# Altium schematic sheet Peripheral.SchDoc
size A4; DocumentNumber: 3; SheetNumber: 3; SheetTotal: 4
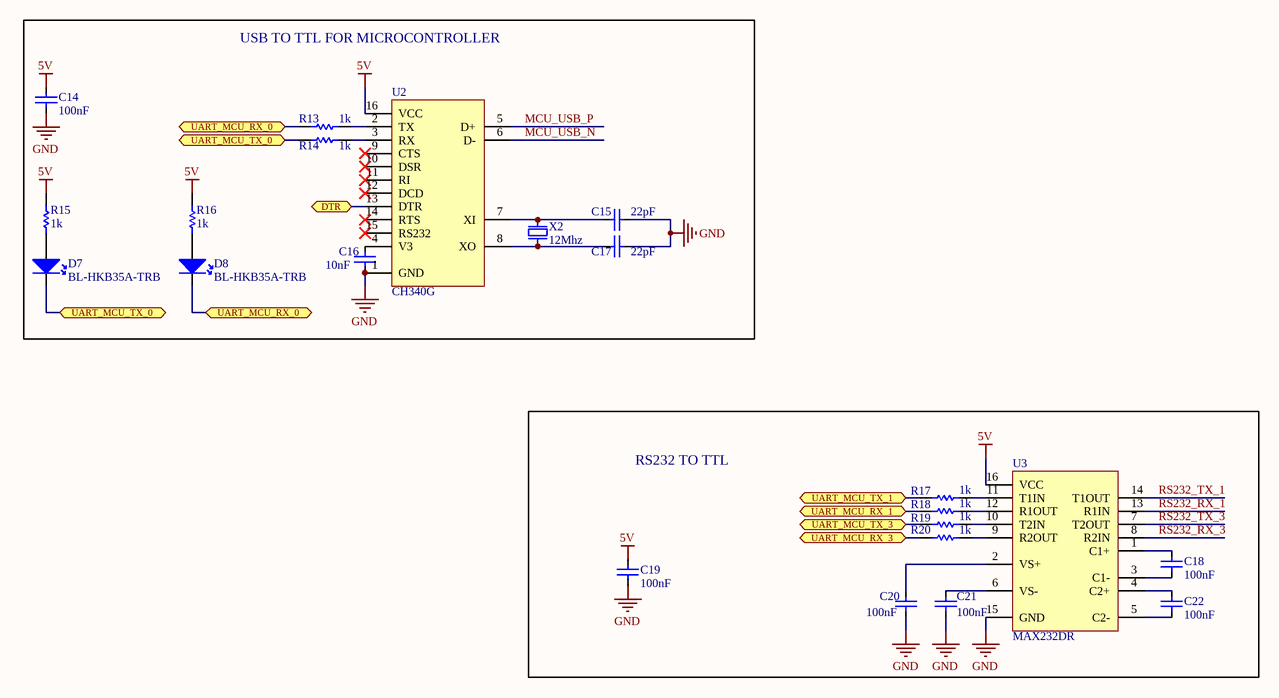
[diagram p0: Peripheral.SchDoc]

## Parts
?  (no value)  (graphical)
C14  100nF  [CAP-0603]
C15  22pF  [CAP-0805]
C16  10nF  [CAP-0603]
C17  22pF  [CAP-0805]
C18  100nF  [CAP-0603]
C19  100nF  [CAP-0603]
C20  100nF  [CAP-0603]
C21  100nF  [CAP-0603]
C22  100nF  [CAP-0603]
D7  BL-HKB35A-TRB  [LED-0805]
D8  BL-HKB35A-TRB  [LED-0805]
R13  1k  [RES-0603]
R14  1k  [RES-0603]
R15  1k  [RES-0603]
R16  1k  [RES-0603]
R17  1k  [RES-0603]
R18  1k  [RES-0603]
R19  1k  [RES-0603]
R20  1k  [RES-0603]
U2  CH340G  [16-SOIC_CH340G]
U3  MAX232DR  [16-SOIC_MAX232DR]
X2  12Mhz  [OSC-THT (11.5*5.00*3.60)]

## Blocks framed on the sheet
USB TO TTL FOR MICROCONTROLLER: C14-C17 D7 D8 R13-R16 U2 X2
RS232 TO TTL: C18-C22 R17-R20 U3

## Ports
DTR (bidir), UART_MCU_RX_0 (bidir), UART_MCU_RX_1 (bidir), UART_MCU_RX_3 (bidir), UART_MCU_TX_0 (bidir), UART_MCU_TX_1 (bidir), UART_MCU_TX_3 (bidir)

## Nets
5V: C14.2 C19.2 R15.2 R16.2 U2.16(VCC) U3.16(VCC)
GND: C14.1 C15.1 C16.1 C17.1 C19.1 C20.1 C21.1 U2.1(GND) U3.15(GND)
DTR: U2.13(DTR) ; port DTR
MCU_USB_N: U2.6(D-)
MCU_USB_P: U2.5(D+)
RS232_RX_1: U3.13(R1IN)
RS232_RX_3: U3.8(R2IN)
RS232_TX_1: U3.14(T1OUT)
RS232_TX_3: U3.7(T2OUT)
UART_MCU_RX_0: D8.2(K) R13.2 ; port UART_MCU_RX_0
UART_MCU_RX_1: R18.2 ; port UART_MCU_RX_1
UART_MCU_RX_3: R20.2 ; port UART_MCU_RX_3
UART_MCU_TX_0: D7.2(K) R14.2 ; port UART_MCU_TX_0
UART_MCU_TX_1: R17.2 ; port UART_MCU_TX_1
UART_MCU_TX_3: R19.2 ; port UART_MCU_TX_3
NetC15_2: C15.2 U2.7(XI) X2.2
NetC16_2: C16.2 U2.4(V3)
NetC17_2: C17.2 U2.8(XO) X2.1
NetC18_1: C18.1 U3.3(C1-)
NetC18_2: C18.2 U3.1(C1+)
NetC20_2: C20.2 U3.2(VS+)
NetC21_2: C21.2 U3.6(VS-)
NetC22_1: C22.1 U3.5(C2-)
NetC22_2: C22.2 U3.4(C2+)
NetD7_1: D7.1(A) R15.1
NetD8_1: D8.1(A) R16.1
NetR13_1: R13.1 U2.2(TX)
NetR14_1: R14.1 U2.3(RX)
NetR17_1: R17.1 U3.11(T1IN)
NetR18_1: R18.1 U3.12(R1OUT)
NetR19_1: R19.1 U3.10(T2IN)
NetR20_1: R20.1 U3.9(R2OUT)

Not connected (* = marked no-connect by the designer): U2 9(CTS)* 10(DSR)* 11(RI)* 12(DCD)* 14(RTS)* 15(RS232)*

## Notes on the sheet
- Project Name :
- Karadeniz Technical
- Date :
- Drawn by :
- Name :
- Sheet :
- /
- University
- Trabzon / Turkey

## Library data of the parts
? = Title Block: Standart Title Block
C14 C18-C22 = CGA3E2X7R1H104K080AA: Manufacturer: TDK; Temperature Coefficient: X7R; Voltage: 50V; Library Reference: Capacitor; Tolerance: %10; Man Code: CGA3E2X7R1H104K080AA; Value: 100nF; Footprint: 0603; Component Type: Ceramic Capacitor
C15 C17 = CL21C220JBANNNC: Manufacturer: Samsung Electro-Mechanics; Temperature Coefficient: C0G; Voltage: 50V; Library Reference: Capacitor; Tolerance: %5; Man Code: CL21C220JBANNNC; Value: 22pF; Footprint: 0805; Component Type: Ceramic Capacitor
C16 = 06031C103K4T4A: Manufacturer: AVX; Temperature Coefficient: X7R; Voltage: 100V; Library Reference: Capacitor; Tolerance: %10; Man Code: 06031C103K4T4A; Value: 10nF; Footprint: 0603; Component Type: Ceramic Capacitor
D7 D8 = BL-HKB35A-TRB: Manufacturer: BRIGHT LED; Colour: Yellow; Vf: 2.2V; Library Reference: Miscellaneous; Luminous Intensity: 94mcd; If: 20mA; Lens Transparency: Water Clear; Man Code: BL-HKB35A-TRB; Footprint: 0805; Component Type: Led
R13-R20 = CRCW06031K00FKEAC: Manufacturer: Vishay; Tolerance: %1; Power: 0.1W; Library Reference: Resistor; Man Code: CRCW06031K00FKEAC; Value: 1k; Footprint: 0603; Component Type: Chip Resistor
U2 = CH340G: Library Reference: Integrated_Circuit; Man Code: CH340G; Footprint: 16-SOIC; Component Type: USB-TTL Converter
U3 = MAX232DR: Manufacturer: Texas Instruments; Library Reference: Integrated_Circuit; Data Rate: 120Kbps; Supply Voltage: 4.5V - 5.5V; Man Code: MAX232DR; Footprint: 16-SOIC; Component Type: RS-232 Transceiver
X2 = AS49S-12M-FC160F3: Manufacturer: ANSEN; Frequency Tolerance: 20ppm; Frequency Stability: 50ppm; Library Reference: Miscellaneous; Capacitance: 16pF; ESR: 40ohm; Man Code: AS49S-12M-FC160F3; Value: 12Mhz; Footprint: THT (11.5*5.00*3.60); Component Type: Crystal Oscillator